# EAGLE design X14-Backplane (EAGLE 9.5.0)
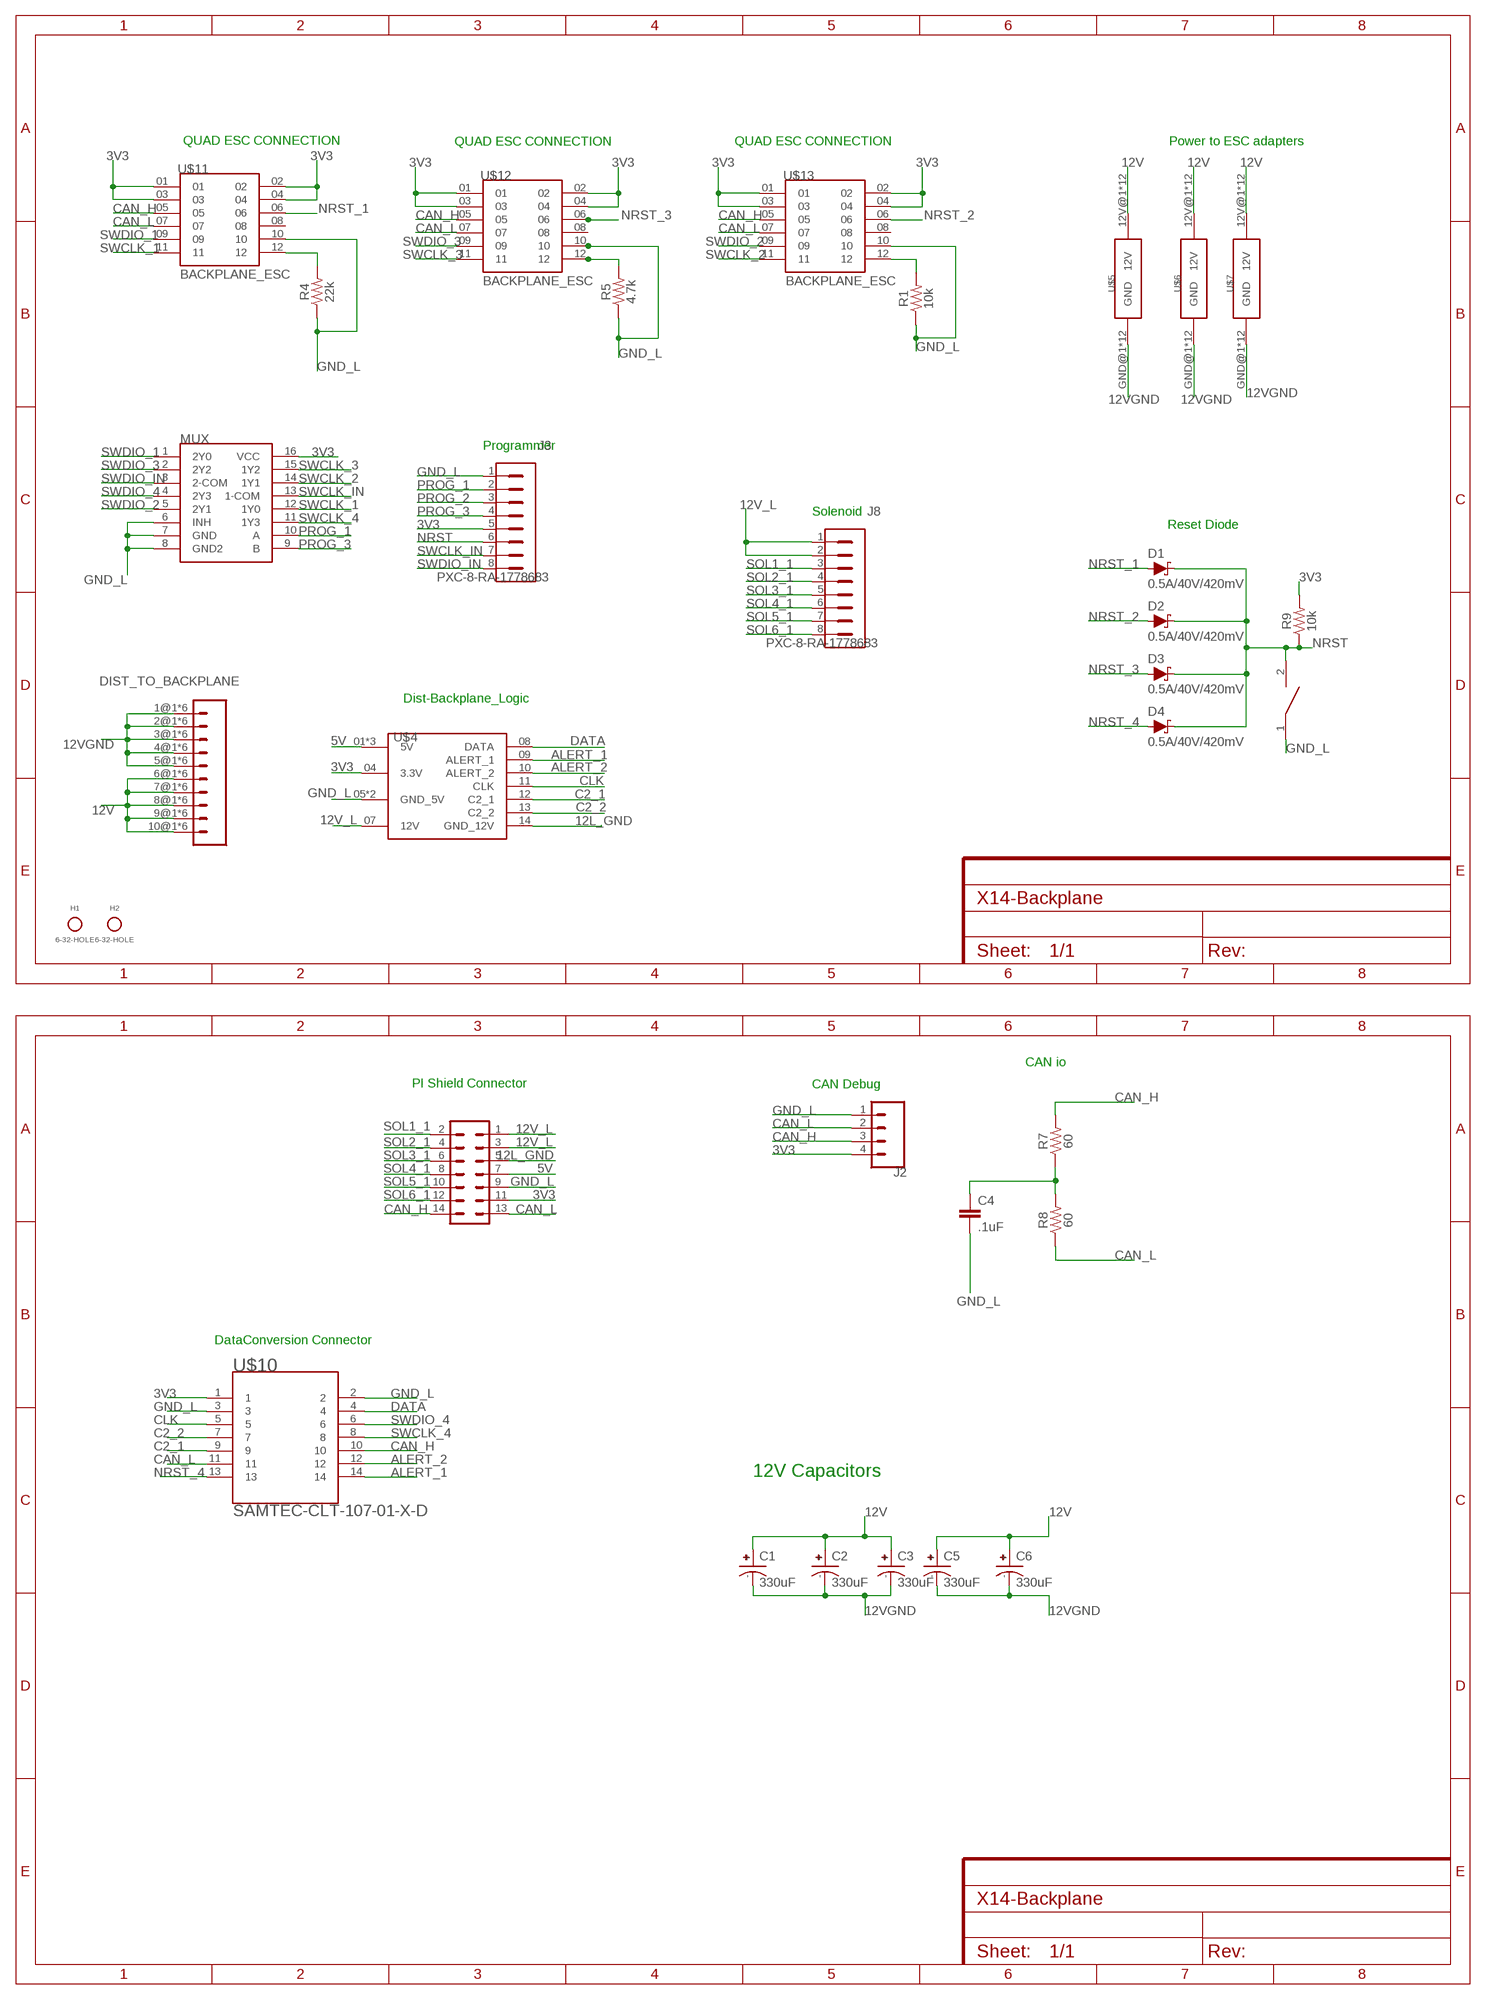
[diagram p0: schematic, sheet 1]

## Parts
C1  330uF  UCM1H331MNL1GS  [CAPAE1030X1050N]
C2  330uF  UCM1H331MNL1GS  [CAPAE1030X1050N]
C3  330uF  UCM1H331MNL1GS  [CAPAE1030X1050N]
C4  .1uF  10NF-0603-50V-10%  [0603]
C5  330uF  UCM1H331MNL1GS  [CAPAE1030X1050N]
C6  330uF  UCM1H331MNL1GS  [CAPAE1030X1050N]
D1  0.5A/40V/420mV  DIODE-SCHOTTKY-PMEG4005EJ  [SOD-323]
D2  0.5A/40V/420mV  DIODE-SCHOTTKY-PMEG4005EJ  [SOD-323]
D3  0.5A/40V/420mV  DIODE-SCHOTTKY-PMEG4005EJ  [SOD-323]
D4  0.5A/40V/420mV  DIODE-SCHOTTKY-PMEG4005EJ  [SOD-323]
DIST_TO_BACKPLANE  MPPT-10-01-01-L-RA-SD  [MPPT-10-01-01-L-RA-SD]
H1  6-32-HOLE  [6-32-HOLE]
H2  6-32-HOLE  [6-32-HOLE]
J2  PXC-PTSM-04-RA-1778641  [PXC-PTSM-04-RA-1778641]
J3  PXC-8-RA-1778683  [PXC-8-RA-1778683]
J8  PXC-8-RA-1778683  [PXC-8-RA-1778683]
MUX  TI-SN74LV4052A  [SOIC-16]
R1  10k  10KOHM-0603-1/10W-1%  [0603]
R4  22k  26.7KOHM0603-1/10W-1%  [0603]
R5  4.7k  1KOHM-0603-1/10W-1%  [0603]
R7  60  68.1KOHM-0603-1/10W-1%  [0603]
R8  60  68.1KOHM-0603-1/10W-1%  [0603]
R9  10k  10KOHM-0603-1/10W-1%  [0603]
U$4  BACKPLANE-DISTRIBUTION  [SAMTEC_IPL1-107-01-X-D-K(B-D)]
U$5  BACKPLANE_ESC_ADAPTER_PWRBKP  [BACKPLANE_ESC_ADAPTER_BKP_PWR]
U$6  BACKPLANE_ESC_ADAPTER_PWRBKP  [BACKPLANE_ESC_ADAPTER_BKP_PWR]
U$7  BACKPLANE_ESC_ADAPTER_PWRBKP  [BACKPLANE_ESC_ADAPTER_BKP_PWR]
U$8  DISCRETECOMPONENTS_SWITCH  [DISCRETECOMPONENTS_SW_2512]
U$9  7X_CONN  [IPL7X2]
U$10  BACKPLANE->DATACONV  [SAMTEC-CLT-107-01-X-D-BACKPLANE]
U$11  BACKPLANE_ESC  [SAMTEC_SQT-107-01-F-D]
U$12  BACKPLANE_ESC  [SAMTEC_SQT-107-01-F-D]
U$13  BACKPLANE_ESC  [SAMTEC_SQT-107-01-F-D]

## Nets
3V3: J2.4 J3.5 MUX.16(VCC) R9.2 U$4.04(3.3V) U$9.11 U$10.1 U$11.01 U$11.02 U$11.03 U$11.04 U$12.01 U$12.02 U$12.03 U$12.04 U$13.01 U$13.02 U$13.03 U$13.04
5V: U$4.01(5V) U$4.02(5V) U$4.03(5V) U$9.7
12L_GND: U$4.14(GND_12V) U$9.5
12V: C1.+ C2.+ C3.+ C5.+ C6.+ DIST_TO_BACKPLANE.6@1 DIST_TO_BACKPLANE.6@2 DIST_TO_BACKPLANE.6@3 DIST_TO_BACKPLANE.6@4 DIST_TO_BACKPLANE.6@5 DIST_TO_BACKPLANE.6@6 DIST_TO_BACKPLANE.7@1 DIST_TO_BACKPLANE.7@2 DIST_TO_BACKPLANE.7@3 DIST_TO_BACKPLANE.7@4 DIST_TO_BACKPLANE.7@5 DIST_TO_BACKPLANE.7@6 DIST_TO_BACKPLANE.8@1 DIST_TO_BACKPLANE.8@2 DIST_TO_BACKPLANE.8@3 DIST_TO_BACKPLANE.8@4 DIST_TO_BACKPLANE.8@5 DIST_TO_BACKPLANE.8@6 DIST_TO_BACKPLANE.9@1 DIST_TO_BACKPLANE.9@2 DIST_TO_BACKPLANE.9@3 DIST_TO_BACKPLANE.9@4 DIST_TO_BACKPLANE.9@5 DIST_TO_BACKPLANE.9@6 DIST_TO_BACKPLANE.10@1 DIST_TO_BACKPLANE.10@2 DIST_TO_BACKPLANE.10@3 DIST_TO_BACKPLANE.10@4 DIST_TO_BACKPLANE.10@5 DIST_TO_BACKPLANE.10@6 U$5.12V@1(12V) U$5.12V@2(12V) U$5.12V@3(12V) U$5.12V@4(12V) U$5.12V@5(12V) U$5.12V@6(12V) U$5.12V@7(12V) U$5.12V@8(12V) U$5.12V@9(12V) U$5.12V@10(12V) U$5.12V@11(12V) U$5.12V@12(12V) U$6.12V@1(12V) U$6.12V@2(12V) U$6.12V@3(12V) U$6.12V@4(12V) U$6.12V@5(12V) U$6.12V@6(12V) U$6.12V@7(12V) U$6.12V@8(12V) U$6.12V@9(12V) U$6.12V@10(12V) U$6.12V@11(12V) U$6.12V@12(12V) U$7.12V@1(12V) U$7.12V@2(12V) U$7.12V@3(12V) U$7.12V@4(12V) U$7.12V@5(12V) U$7.12V@6(12V) U$7.12V@7(12V) U$7.12V@8(12V) U$7.12V@9(12V) U$7.12V@10(12V) U$7.12V@11(12V) U$7.12V@12(12V)
12V_L: J8.1 J8.2 U$4.07(12V) U$9.1 U$9.3
12VGND: C1.- C2.- C3.- C5.- C6.- DIST_TO_BACKPLANE.1@1 DIST_TO_BACKPLANE.1@2 DIST_TO_BACKPLANE.1@3 DIST_TO_BACKPLANE.1@4 DIST_TO_BACKPLANE.1@5 DIST_TO_BACKPLANE.1@6 DIST_TO_BACKPLANE.2@1 DIST_TO_BACKPLANE.2@2 DIST_TO_BACKPLANE.2@3 DIST_TO_BACKPLANE.2@4 DIST_TO_BACKPLANE.2@5 DIST_TO_BACKPLANE.2@6 DIST_TO_BACKPLANE.3@1 DIST_TO_BACKPLANE.3@2 DIST_TO_BACKPLANE.3@3 DIST_TO_BACKPLANE.3@4 DIST_TO_BACKPLANE.3@5 DIST_TO_BACKPLANE.3@6 DIST_TO_BACKPLANE.4@1 DIST_TO_BACKPLANE.4@2 DIST_TO_BACKPLANE.4@3 DIST_TO_BACKPLANE.4@4 DIST_TO_BACKPLANE.4@5 DIST_TO_BACKPLANE.4@6 DIST_TO_BACKPLANE.5@1 DIST_TO_BACKPLANE.5@2 DIST_TO_BACKPLANE.5@3 DIST_TO_BACKPLANE.5@4 DIST_TO_BACKPLANE.5@5 DIST_TO_BACKPLANE.5@6 U$5.GND@1(GND) U$5.GND@2(GND) U$5.GND@3(GND) U$5.GND@4(GND) U$5.GND@5(GND) U$5.GND@6(GND) U$5.GND@7(GND) U$5.GND@8(GND) U$5.GND@9(GND) U$5.GND@10(GND) U$5.GND@11(GND) U$5.GND@12(GND) U$6.GND@1(GND) U$6.GND@2(GND) U$6.GND@3(GND) U$6.GND@4(GND) U$6.GND@5(GND) U$6.GND@6(GND) U$6.GND@7(GND) U$6.GND@8(GND) U$6.GND@9(GND) U$6.GND@10(GND) U$6.GND@11(GND) U$6.GND@12(GND) U$7.GND@1(GND) U$7.GND@2(GND) U$7.GND@3(GND) U$7.GND@4(GND) U$7.GND@5(GND) U$7.GND@6(GND) U$7.GND@7(GND) U$7.GND@8(GND) U$7.GND@9(GND) U$7.GND@10(GND) U$7.GND@11(GND) U$7.GND@12(GND)
ALERT_1: U$4.09(ALERT_1) U$10.14
ALERT_2: U$4.10(ALERT_2) U$10.12
C2_1: U$4.12(C2_1) U$10.9
C2_2: U$4.13(C2_2) U$10.7
CAN_H: J2.3 R7.2 U$9.14 U$10.10 U$11.05 U$12.05 U$13.05
CAN_L: J2.2 R8.1 U$9.13 U$10.11 U$11.07 U$12.07 U$13.07
CLK: U$4.11(CLK) U$10.5
DATA: U$4.08(DATA) U$10.4
ESCID_1: R4.2 U$11.12
ESCID_2: R1.2 U$13.12
ESCID_3: R5.2 U$12.12
GND_L: C4.2 J2.1 J3.1 MUX.6(INH) MUX.7(GND) MUX.8(GND2) R1.1 R4.1 R5.1 U$4.05(GND_5V) U$4.06(GND_5V) U$8.1 U$9.9 U$10.2 U$10.3 U$11.10 U$12.10 U$13.10
N$3: C4.1 R7.1 R8.2
NRST: D1.C D2.C D3.C D4.C J3.6 R9.1 U$8.2
NRST_1: D1.A U$11.06
NRST_2: D2.A U$13.06
NRST_3: D3.A U$12.06
NRST_4: D4.A U$10.13
PROG_1: J3.2 MUX.10(A)
PROG_2: J3.3
PROG_3: J3.4 MUX.9(B)
SOL1_1: J8.3 U$9.2
SOL2_1: J8.4 U$9.4
SOL3_1: J8.5 U$9.6
SOL4_1: J8.6 U$9.8
SOL5_1: J8.7 U$9.10
SOL6_1: J8.8 U$9.12
SWCLK_1: MUX.12(1Y0) U$11.11
SWCLK_2: MUX.14(1Y1) U$13.11
SWCLK_3: MUX.15(1Y2) U$12.11
SWCLK_4: MUX.11(1Y3) U$10.8
SWCLK_IN: J3.7 MUX.13(1-COM)
SWDIO_1: MUX.1(2Y0) U$11.09
SWDIO_2: MUX.5(2Y1) U$13.09
SWDIO_3: MUX.2(2Y2) U$12.09
SWDIO_4: MUX.4(2Y3) U$10.6
SWDIO_IN: J3.8 MUX.3(2-COM)
Unconnected: U$11.08 U$12.08 U$13.08

## Notes on the sheet
- QUAD ESC CONNECTION | QUAD ESC CONNECTION | QUAD ESC CONNECTION | Power to ESC adapters
- Programmer
- Solenoid
- Reset Diode
- Dist-Backplane_Logic
- CAN io
- PI Shield Connector | CAN Debug
- DataConversion Connector
- 12V Capacitors

## Library data of the parts
C1-C3 C5 C6 = CAP, aluminin-capacitor-brick-UCM1H331MNL1GS:UCM1H331MNL1GS: Nichicon 330uF 50 V Aluminium Electrolytic Capacitor SMD, CM Series 2000h 10 (Dia.) x 10mm Source: Datasheet <http://www.nichicon.co.jp/english/products/pdfs/e-ucm.pdf>; ARROW_PART_NUMBER: UCM1H331MNL1GS; ARROW_PRICE-STOCK: https://www.arrow.com/en/products/ucm1h331mnl1gs/nichicon; DESCRIPTION: Nichicon 330uF 50 V Aluminium Electrolytic Capacitor SMD, CM Series 2000h 10 (Dia.) x 10mm; HEIGHT: 10.5mm; MANUFACTURER_NAME: Nichicon; MANUFACTURER_PART_NUMBER: UCM1H331MNL1GS; MOUSER_PART_NUMBER: 647-UCM1H331MNL1GS; MOUSER_PRICE-STOCK: https://www.mouser.co.uk/ProductDetail/Nichicon/UCM1H331MNL1GS?qs=DSgADHjnLTkTovFLdbC%252BNg%3D%3D
C4 = SparkFun-Capacitors:10NF: 0.01uF/10nF/10,000pF ceramic capacitors A capacitor is a passive two-terminal electrical component used to store electrical energy temporarily in an electric field. CAP-09321; PROD_ID: CAP-00867; VALUE: 10nF
D1-D4 = SparkFun-DiscreteSemi:DIODE-SCHOTTKY: Schottky diode A Schottky diode is a semiconductor diode which has a low forward voltage drop and a very fast switching action.; PROD_ID: DIO-10955
DIST_TO_BACKPLANE = CONN, Samtec MPPT Hermaphoditic 10 pos - MPPT-10-01-01-L-RA-SD:MPPT-10-01-01-L-RA-SD: Samtec MPPT Connector Right Angle Vertically mating Non-gendered https://www.samtec.com/products/mppt-10-01-01-l-ra-sd
H1 H2 = Mounting Holes:6-32-HOLE
J2 = CONN, Phoenix Contact PTSM-04-V-1778573:PXC-PTSM-04-RA-1778641
J3 J8 = CONN, Phoenix Contact PTSM 8 pin:PXC-8-RA-1778683
MUX = BackplaneMUX:TI-SN74LV4052A
R1 R9 = SparkFun-Resistors:10KOHM: 10kΩ resistor A resistor is a passive two-terminal electrical component that implements electrical resistance as a circuit element. Resistors act to reduce current flow, and, at the same time, act to lower voltage levels within circuits. - Wikipedia; PROD_ID: RES-00824
R4 = SparkFun-Resistors:26.7KOHM: 26.7kΩ resistor A resistor is a passive two-terminal electrical component that implements electrical resistance as a circuit element. Resistors act to reduce current flow, and, at the same time, act to lower voltage levels within circuits. - Wikipedia; PROD_ID: RES-12186; VALUE: 26.7k
R5 = SparkFun-Resistors:1KOHM: 1kΩ resistor A resistor is a passive two-terminal electrical component that implements electrical resistance as a circuit element. Resistors act to reduce current flow, and, at the same time, act to lower voltage levels within circuits. - Wikipedia; PROD_ID: RES-07856; VALUE: 1k
R7 R8 = SparkFun-Resistors:68.1KOHM: 68.1kΩ resistor A resistor is a passive two-terminal electrical component that implements electrical resistance as a circuit element. Resistors act to reduce current flow, and, at the same time, act to lower voltage levels within circuits. - Wikipedia; PROD_ID: RES-09380; VALUE: 68.1k
U$4 = CONN, Distribution-Backplane:BACKPLANE-DISTRIBUTION
U$5-U$7 = CONN, Backplane_ESC_adapter:BACKPLANE_ESC_ADAPTER_PWR
U$8 = OTHER, Push button - FSM2JMTR:DISCRETECOMPONENTS_SWITCH: TE Connectivity FSM2JMTR Switch
U$9 = PI-SHIELD, Solenoid-Backplane:7X_CONN
U$10 = CONN, DataConversion-Backplane Connector- SAMTEC CLT-107-01-F-D:BACKPLANE->DATACONV
U$11-U$13 = SQT-106-01-F-D:BACKPLANE_ESC

## Net classes
2 5V: width 0.508 mm

## Board
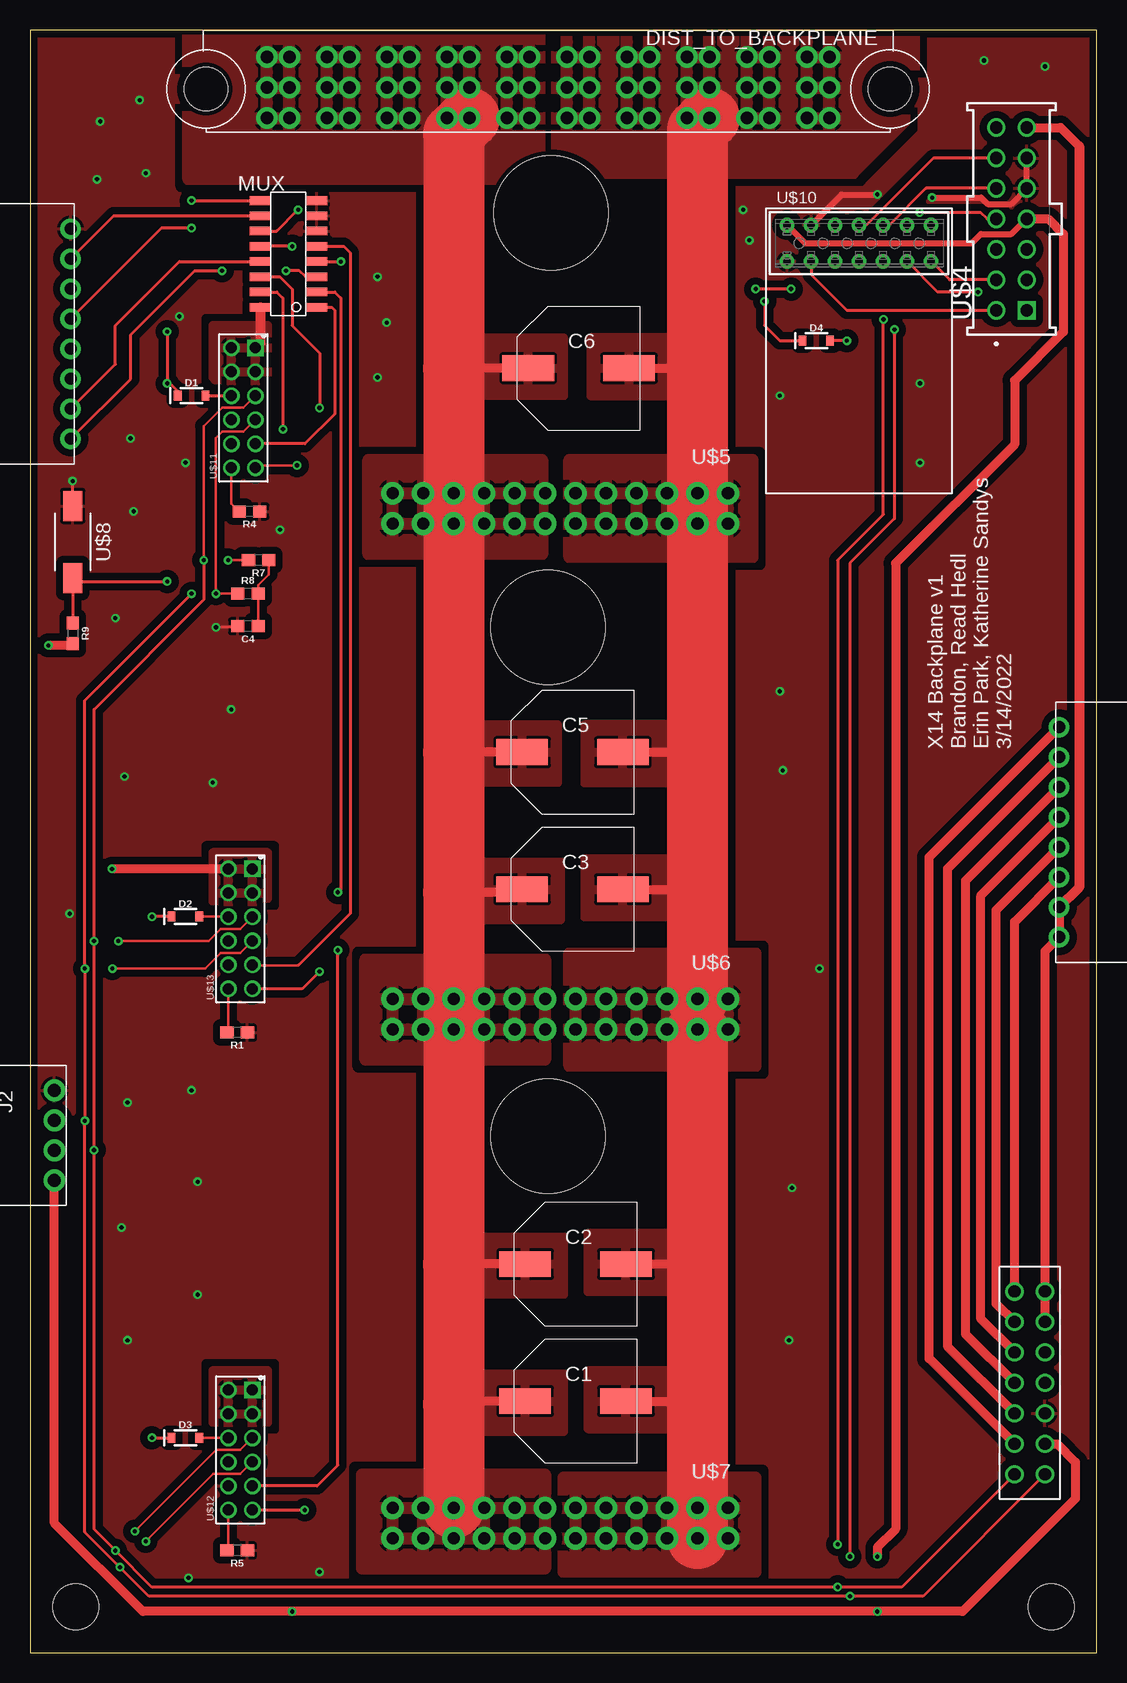
[diagram p1: board, top side]
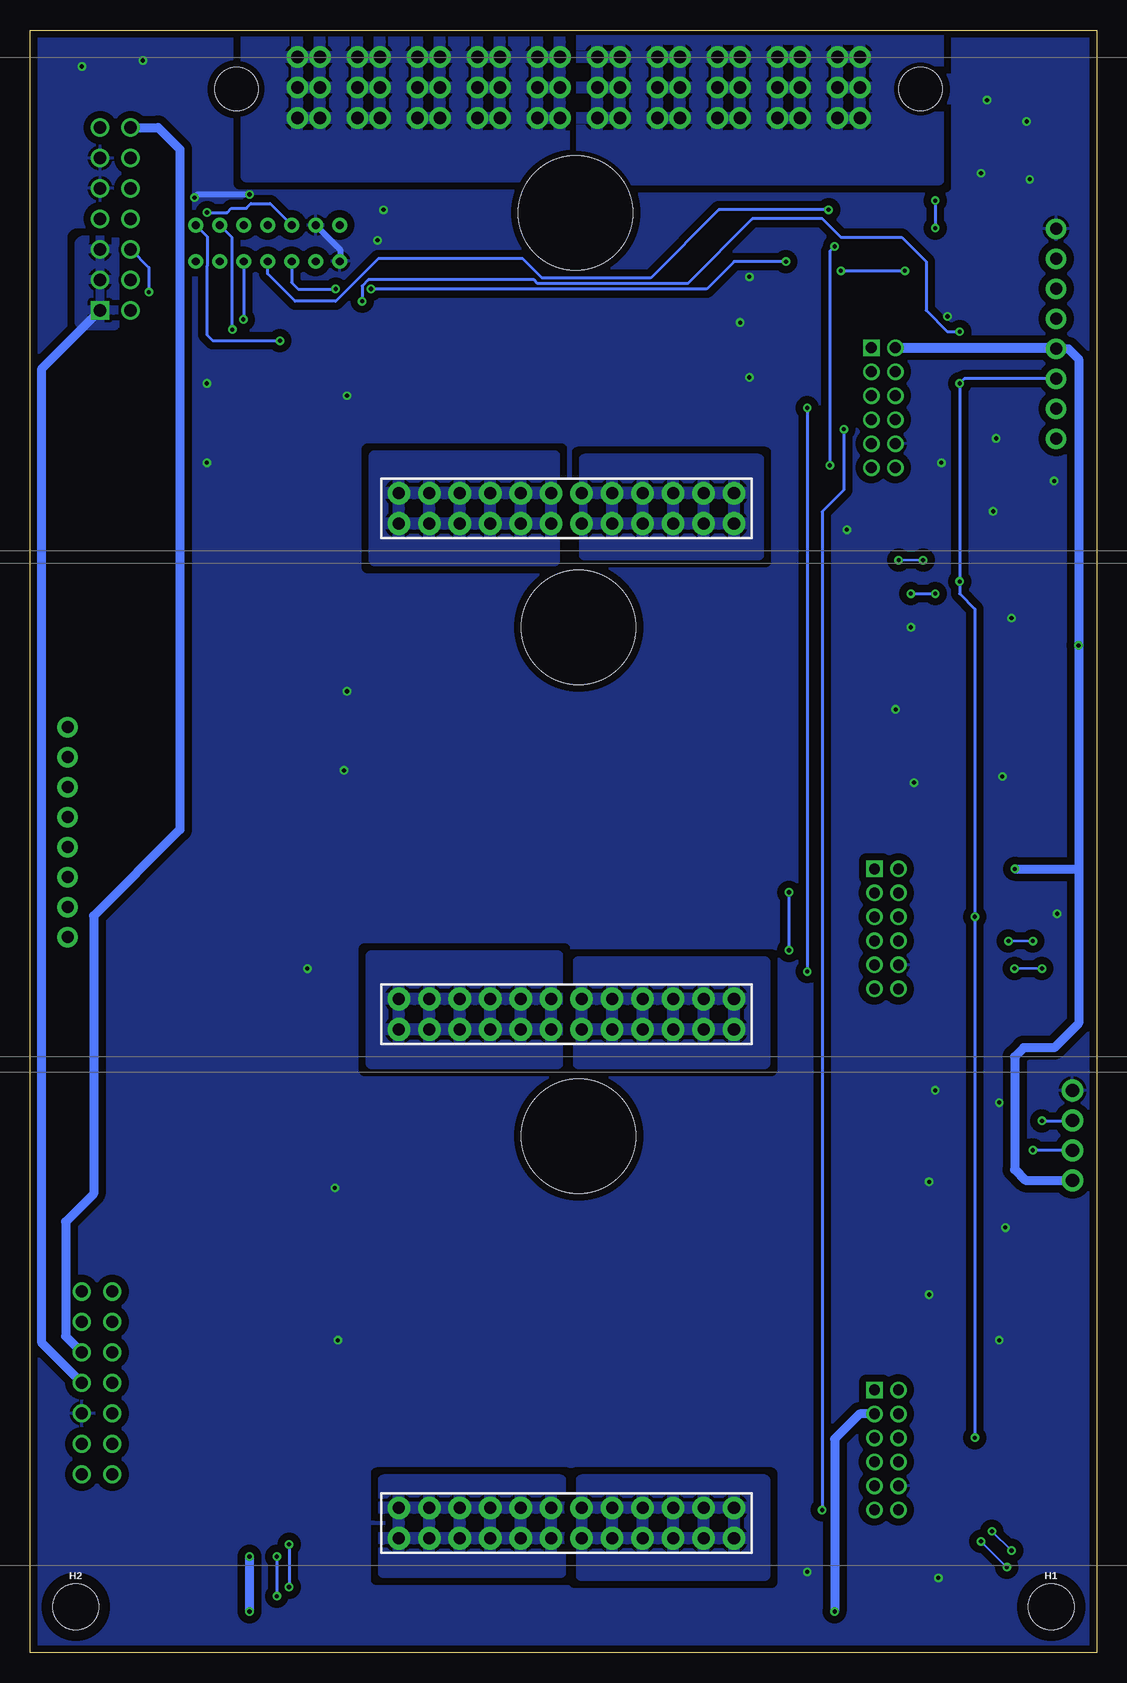
[diagram p2: board, bottom side, seen from below]

Size 88.9 x 135.25 mm. Coordinates in mm from the lower left corner, seen from the top.
Outline: 0,0 88.9,0 88.9,135.25 0,135.25 0,0
Copper layers (1*16): Top 0.0356mm / dielectric 1.5011mm / Bottom 0.0356mm
Design rules "ECE_Senior_Design": minimum track width 8mil, minimum drill 13mil, track to track 8mil, track to pad 8mil, pad to pad 6mil, via to via 8mil, smd to smd 6mil, copper to edge 15mil, drill to drill 8mil, minimum pad ring 7mil, minimum via ring 7mil, stop-mask expansion 3mil, vias tented up to drill 0mil, thermal gap 10mil
Holes 9.53 mm at 43.18,43.05 43.18,85.47 43.43,120.01

### Footprints (pad centres in the part's own frame; a part is rotated, then mirrored left to right if it is on the bottom)
CAPAE1030X1050N = smd 4.3 x 2.15: + -4.2,0; - 4.2,0
0603 = smd 1.1 x 1: 1 -0.85,0; 2 0.85,0
SOD-323 = smd 0.63 x 0.83: A 1.15,0; C -1.15,0
MPPT-10-01-01-L-RA-SD = drill 1.04 pad 1.8: 1@1 -23.44,2.26; 1@2 -21.56,2.26; 1@3 -23.44,4.8; 1@4 -21.56,4.8; 1@5 -23.44,7.34; 1@6 -21.56,7.34; 2@1 -18.44,2.26; 2@2 -16.56,2.26; 2@3 -18.44,4.8; 2@4 -16.56,4.8; 2@5 -18.44,7.34; 2@6 -16.56,7.34; 3@1 -13.44,2.26; 3@2 -11.56,2.26; 3@3 -13.44,4.8; 3@4 -11.56,4.8; 3@5 -13.44,7.34; 3@6 -11.56,7.34; 4@1 -8.44,2.26; 4@2 -6.56,2.26; 4@3 -8.44,4.8; 4@4 -6.56,4.8; 4@5 -8.44,7.34; 4@6 -6.56,7.34; 5@1 -3.44,2.26; 5@2 -1.56,2.26; 5@3 -3.44,4.8; 5@4 -1.56,4.8; 5@5 -3.44,7.34; 5@6 -1.56,7.34; 6@1 1.56,2.26; 6@2 3.44,2.26; 6@3 1.56,4.8; 6@4 3.44,4.8; 6@5 1.56,7.34; 6@6 3.44,7.34; 7@1 6.56,2.26; 7@2 8.44,2.26; 7@3 6.56,4.8; 7@4 8.44,4.8; 7@5 6.56,7.34; 7@6 8.44,7.34; 8@1 11.56,2.26; 8@2 13.44,2.26; 8@3 11.56,4.8; 8@4 13.44,4.8; 8@5 11.56,7.34; 8@6 13.44,7.34; 9@1 16.56,2.26; 9@2 18.44,2.26; 9@3 16.56,4.8; 9@4 18.44,4.8; 9@5 16.56,7.34; 9@6 18.44,7.34; 10@1 21.56,2.26; 10@2 23.44,2.26; 10@3 21.56,4.8; 10@4 23.44,4.8; 10@5 21.56,7.34; 10@6 23.44,7.34 | hole 3.6: 28.5,4.93; -28.5,4.93
6-32-HOLE = hole 3.81: 0,0
PXC-PTSM-04-RA-1778641 = drill 1.1 pad 1.8: 1 0,0; 2 2.5,0; 3 5,0; 4 7.5,0
PXC-8-RA-1778683 = drill 1 pad 1.7: 1 2.1,7.2; 2 4.6,7.2; 3 7.1,7.2; 4 9.6,7.2; 5 12.1,7.2; 6 14.6,7.2; 7 17.1,7.2; 8 19.6,7.2
SOIC-16 = smd 1.78 x 0.72: 1 0,0; 2 0,-1.27; 3 0,-2.54; 4 0,-3.81; 5 0,-5.08; 6 0,-6.35; 7 0,-7.62; 8 0,-8.89; 9 4.68,-8.89; 10 4.68,-7.62; 11 4.68,-6.35; 12 4.68,-5.08; 13 4.68,-3.81; 14 4.68,-2.54; 15 4.68,-1.27; 16 4.68,0
SAMTEC_IPL1-107-01-X-D-K(B-D) = drill 1.02 square: 01 -7.62,-1.27 | drill 1.02: 02 -5.08,-1.27; 03 -2.54,-1.27; 04 0,-1.27; 05 2.54,-1.27; 06 5.08,-1.27; 07 7.62,-1.27; 08 -7.62,1.27; 09 -5.08,1.27; 10 -2.54,1.27; 11 0,1.27; 12 2.54,1.27; 13 5.08,1.27; 14 7.62,1.27
BACKPLANE_ESC_ADAPTER_BKP_PWR = drill 1.016 pad 1.88: 12V@1 65.024,36.322; 12V@2 65.024,38.862; 12V@3 62.484,36.322; 12V@4 62.484,38.862; 12V@5 59.944,36.322; 12V@6 59.944,38.862; 12V@7 57.404,36.322; 12V@8 57.404,38.862; 12V@9 54.864,36.322; 12V@10 54.864,38.862; 12V@11 52.324,36.322; 12V@12 52.324,38.862; GND@1 49.784,38.862; GND@2 49.784,36.322; GND@3 47.244,38.862; GND@4 47.244,36.322; GND@5 44.704,38.862; GND@6 44.704,36.322; GND@7 42.164,38.862; GND@8 42.164,36.322; GND@9 39.624,38.862; GND@10 39.624,36.322; GND@11 37.084,38.862; GND@12 37.084,36.322
DISCRETECOMPONENTS_SW_2512 = smd 2.5 x 1.6: 1 -3,0; 2 3,0
IPL7X2 = drill 1.016 pad 1.524: 1 2.032,3.81; 2 2.032,1.27; 3 4.572,3.81; 4 4.572,1.27; 5 7.112,3.81; 6 7.112,1.27; 7 9.652,3.81; 8 9.652,1.27; 9 12.192,3.81; 10 12.192,1.27; 11 14.732,3.81; 12 14.732,1.27; 13 17.272,3.81; 14 17.272,1.27
SAMTEC-CLT-107-01-X-D-BACKPLANE = drill 0.64 pad 1.24: 1 -6,1.511; 2 -6,-1.511; 3 -4,1.511; 4 -4,-1.511; 5 -2,1.511; 6 -2,-1.511; 7 0,1.511; 8 0,-1.511; 9 2,1.511; 10 2,-1.511; 11 4,1.511; 12 4,-1.511; 13 6,1.511; 14 6,-1.511
SAMTEC_SQT-107-01-F-D = drill 0.91 pad 1.26 square: 01 5,-1 | drill 0.91 pad 1.26: 02 5,1; 03 3,-1; 04 3,1; 05 1,-1; 06 1,1; 07 -1,-1; 08 -1,1; 09 -3,-1; 10 -3,1; 11 -5,-1; 12 -5,1

### Placement (x,y rotation side)
C1  45.47,20.95 0 top
C2  45.47,32.38 0 top
C3  45.21,63.63 0 top
C4  18.16,85.55 180 top
C5  45.21,75.06 0 top
C6  45.72,107.06 0 top
D1  13.46,104.78 0 top
D2  12.95,61.34 0 top
D3  12.95,17.91 0 top
D4  65.53,109.35 0 top
DIST_TO_BACKPLANE  43.18,135.25 180 top
H1  3.81,3.81 0 bottom
H2  85.09,3.81 0 bottom
J2  2.03,46.86 270 top
J3  -3.81,120.78 270 top
J8  92.96,57.53 90 top
MUX  23.88,112.14 180 top
R1  17.27,51.69 180 top
R4  18.29,95.12 180 top
R5  17.27,8.51 180 top
R7  19.05,91.06 180 top
R8  18.16,88.29 0 top
R9  3.56,84.96 270 top
U$4  81.79,119.51 90 top
U$5  95.25,132.97 180 top
U$6  95.25,90.81 180 top
U$7  95.25,48.39 180 top
U$8  3.56,92.58 270 top
U$9  80.77,32.13 270 top
U$10  69.09,117.47 0 top
U$11  17.78,103.76 90 top
U$12  17.53,16.89 90 top
U$13  17.53,60.32 90 top

### Tracks (layer width: path | path; a pad name or v marks a point on that pad's centre or on a via)
3V3  (via drill 0.35)
  Top 0.508: U$10.1 64.6,117.47 78.49,117.47 79.25,118.24 81.79,118.24 U$4.04
  Top 0.762: U$9.11 85.6,17.4 87.12,15.88 87.12,12.83 77.72,3.43 v70.61,3.43 v21.84,3.43 9.4,3.43 2.03,10.79 J2.4 | R9.2 3.39,83.95 v1.52,83.95 | U$4.04 84.84,119.51 86.11,118.24 86.11,110.11 82.04,106.04 82.04,100.71 72.14,90.81 72.14,10.29 70.61,8.76 v70.61,8 | v6.83,65.33 U$13.02
  Top 0.813: MUX.16 19.2,109.18 U$11.01
  Bottom 0.762: 1.52,65.41 v1.52,83.95 1.52,107.82 2.38,108.68 J3.5 | v70.61,8 v70.61,3.43 | 1.52,65.41 1.6,65.33 v6.83,65.33 | v21.84,3.43 21.84,17.81 19.76,19.89 U$12.03 | 1.52,65.41 1.52,52.45 3.56,50.42 6.1,50.42 6.86,49.66 6.86,40.26 5.96,39.36 J2.4
  Bottom 0.813: U$11.02 3.47,108.76 J3.5
  pour Top: 15.24,110.62 15.24,106.3 15.49,106.04 19.81,106.04 19.81,110.62
  pour Top: 15.24,66.68 15.24,62.61 19.56,62.61 19.81,62.87 19.81,66.68
  pour Top: 15.24,23.5 15.24,19.18 19.81,19.18 19.81,23.5
5V
  Bottom 0.762: U$9.7 87.91,25.81 87.91,107.04 U$4.01
  pour Bottom: 82.04,117.73 84.58,117.73 84.84,117.47 84.84,110.87 84.58,110.62 81.79,110.62 81.79,117.73
12L_GND
  Bottom 0.762: U$4.14 78.23,127.13 76.4,125.3 76.4,68.6 83.59,61.42 83.59,38.25 85.93,35.92 85.93,26.36 U$9.5
12V
  Top 0.762: C6.+ 35.31,107.06 | C5.+ 35.31,75.06 | C3.+ 40.76,63.37 35.31,63.37 | C2.+ 35.31,32.38 | C1.+ 35.56,20.95 35.31,20.7
  Top 5.08: DIST_TO_BACKPLANE.7@5 35.31,126.6 35.31,107.06 U$5.12V@5 35.31,75.06 35.31,63.37 U$6.12V@5 35.31,32.38 35.31,20.7 U$7.12V@5
  pour Bottom: 15.75,138.81 40.89,138.81 42.93,136.78 42.93,122.81 13.21,122.81 13.21,136.27
  pour Top: 16.26,139.06 40.64,139.06 42.42,137.29 42.42,122.81 13.21,122.81 13.21,136.02
  pour Top (isolate 0.508): 28.19,99.44 42.67,99.44 42.67,91.57 28.19,91.57
  pour Bottom (isolate 0.508): 28.19,99.44 42.67,99.44 42.67,91.57 28.19,91.57
  pour Top (isolate 0.508): 27.94,57.78 42.93,57.78 42.93,49.4 27.94,49.4
  pour Bottom (isolate 0.508): 27.69,57.53 43.18,57.53 43.18,49.15 27.69,49.15
  pour Top (isolate 0.508): 27.69,14.86 42.93,14.86 42.93,6.98 27.69,6.98
  pour Bottom (isolate 0.508): 27.69,14.35 42.93,14.35 42.93,6.48 27.69,6.48
  pour Top: 36.07,109.6 44.45,109.6 44.45,104.78 36.07,104.78
  pour Top: 36.07,23.24 44.45,23.24 44.45,18.41 36.07,18.41
  pour Top: 36.07,34.67 44.45,34.67 44.45,29.84 36.07,29.84
  pour Top: 35.81,65.91 44.2,65.91 44.2,61.09 35.81,61.09
  pour Top: 35.56,77.34 43.94,77.34 43.94,72.52 35.56,72.52
12V_L
  Top 0.762: J8.2 J8.1 84.58,58.45 U$9.1 U$9.3 | U$4.07 85.88,127.13 87.43,125.58
  Top 0.813: J8.2 87.43,63.79 87.43,125.58
12VGND
  Top 0.762: C6.- 55.63,107.06 | C5.- 55.37,75.06 55.63,74.8 | C3.- 55.37,63.63 55.63,63.37 | C2.- 55.37,32.38 55.63,32.13 | C1.- 55.37,20.95 55.63,20.7
  Top 5.08: U$7.GND@9 55.63,20.7 55.63,32.13 U$6.GND@9 | U$6.GND@10 55.63,63.37 55.63,74.8 U$5.GND@9 55.63,107.06 55.63,126.92 DIST_TO_BACKPLANE.3@5
  pour Top (isolate 0.508): 45.47,138.56 71.63,138.56 73.66,136.53 73.66,128.4 68.58,123.32 43.94,123.32 43.94,137.03
  pour Bottom (isolate 0.508, rank 2): 45.21,91.06 45.21,99.69 60.2,99.69 60.2,91.06
  pour Top (isolate 0.508, rank 2): 44.96,99.44 60.2,99.44 60.2,91.31 44.96,91.31
  pour Bottom (isolate 0.508, rank 2): 44.96,58.04 60.45,58.04 60.45,49.15 44.96,49.15
  pour Top (isolate 0.508, rank 2): 44.96,58.29 60.45,58.29 60.45,48.9 44.96,48.9
  pour Top (isolate 0.508, rank 2): 44.45,14.61 60.45,14.61 60.45,6.73 44.45,6.73
  pour Bottom (isolate 0.508, rank 2): 44.7,14.35 59.44,14.35 59.44,6.73 44.7,6.73
  pour Bottom (isolate 0.508, rank 2): 43.94,136.27 70.87,136.27 70.87,123.06 43.94,123.06
  pour Top: 46.74,109.6 46.74,104.78 55.37,104.78 55.37,109.6
  pour Top: 46.48,23.5 46.48,18.67 55.12,18.67 55.12,23.5
  pour Top: 46.48,34.92 46.48,30.1 55.12,30.1 55.12,34.92
  pour Top: 46.23,66.17 46.23,61.34 54.86,61.34 54.86,66.17
  pour Top: 46.23,77.34 46.23,72.52 54.86,72.52 54.86,77.34
ALERT_1
  Top 0.254: U$4.09 76.62,114.43 U$10.14
ALERT_2  (via drill 0.35)
  Top 0.254: v78.99,113.41 75.64,113.41 U$10.12
  Bottom 0.254: U$4.10 78.99,115.44 v78.99,113.41
C2_1
  Top 0.254: U$4.12 74.66,122.05 71.6,118.99 U$10.9
C2_2
  Top 0.254: U$4.13 75.29,124.59 69.69,118.99 U$10.7
CAN_H  (via drill 0.35)
  Top 0.203: v8.74,10.11 15.52,16.89 17.53,16.89 U$12.05 | v7.37,59.31 14.88,59.31 15.89,60.32 17.53,60.32 U$13.05 | v14.48,91.06 14.48,102.24 16,103.76 17.78,103.76 U$11.05 | R7.2 v16.51,91.06
  Top 0.254: U$9.14 72.64,5.46 v67.31,5.46 10.16,5.46 v7.11,8.51 5.33,10.29 v5.33,41.88 v5.33,59.31 5.33,78.61 14.48,87.76 v14.48,91.06 | v67.31,9.02 67.31,91.06 71.12,94.87 v71.12,111.12
  Bottom 0.203: v8.74,10.11 7.14,8.51 | v5.33,59.31 v7.37,59.31 | v16.51,91.06 v14.48,91.06
  Bottom 0.254: v7.11,8.51 7.14,8.51 | J2.3 5.31,41.86 v5.33,41.88 | U$10.10 71.09,111.16 v71.12,111.12 | v67.31,9.02 v67.31,5.46
CAN_L  (via drill 0.35)
  Top 0.203: v9.65,9.27 15.27,14.89 17.53,14.89 U$12.07 | v6.86,57.02 14.59,57.02 15.89,58.33 17.53,58.33 U$13.07 | R8.1 17.29,88.26 v15.49,88.26 15.49,101.22 16.03,101.76 17.78,101.76 U$11.07
  Top 0.254: U$9.13 74.42,4.7 v68.33,4.7 9.91,4.7 v7.49,7.11 4.57,10.03 v4.57,44.32 v4.57,57.02 4.57,79.38 v13.46,88.26 | v72.03,110.29 72.03,94.51 68.33,90.81 v68.33,8
  Bottom 0.203: v9.65,9.27 v7.49,7.11 | v6.86,57.02 v4.57,57.02
  Bottom 0.254: v15.49,88.26 v13.46,88.26 | v4.57,44.32 2.07,44.32 J2.2 | U$10.11 72.08,117.98 72.08,110.34 v72.03,110.29 | v68.33,8 v68.33,4.7
CLK  (via drill 0.35)
  Top 0.254: U$4.11 79.76,119.51 79.22,120.04 v74.14,120.04
  Bottom 0.254: v74.14,120.04 72.47,120.04 72.11,120.4 70.87,120.4 70.48,120.78 68.89,120.78 U$10.5
DATA
  Top 0.254: U$10.4 65.09,114.87 68.07,111.89 U$4.08
ESCID_1
  Top 0.203: U$11.12 16.78,95.78 R4.2
ESCID_2
  Top 0.203: U$13.12 16.53,51.79 R1.2
ESCID_3
  Top 0.203: U$12.12 16.53,8.61 R5.2
GND_L  (via drill 0.35)
  Top 0.203: C4.2 17.23,85.47 v15.49,85.47
  Top 0.254: U$8.1 v3.56,97.66
  Top 0.508: U$10.3 67.64,121.54 v70.61,121.54 | v75.18,121.28 79.27,121.28 79.8,120.75 81.76,120.75 U$4.05 U$4.06
  Bottom 0.508: v70.61,121.54 74.93,121.54 v75.18,121.28 | U$10.3 63.06,116.95 63.06,116 U$10.2
  other vias: 5.84,127.64 5.59,122.81 9.65,123.32 28.96,114.68 12.45,111.38 9.14,129.41 29.72,110.87 28.96,106.3 62.48,80.14 62.74,73.53 65.79,57.02 63.5,38.73 63.25,26.04 24.13,6.73 15.24,72.52 16.76,78.61 20.83,93.6 13.46,46.86 13.97,39.24 7.62,35.43 13.97,29.84 8.13,26.04 8.13,45.85 7.87,73.03 8.38,101.22 13.21,6.22 59.44,120.27 59.94,117.73 62.48,104.78 79.5,132.72 84.58,132.21 74.17,105.79 74.17,99.19 8.64,95.12 7.11,86.23 3.3,61.6 12.95,99.19
  pour Bottom (isolate 0.61, rank 6): -2.54,137.8 91.44,137.8 91.44,-6.99 -2.54,-6.99
  pour Top (isolate 0.61, rank 6): -2.54,137.8 92.46,137.8 92.46,-7.49 -3.05,-7.49 -3.05,137.8
N$3
  Top 0.203: C4.1 19.01,88.26 R8.2 19.01,88.99 19.9,89.88 R7.1
NRST  (via drill 0.35)
  Top 0.254: R9.1 U$8.2 3.86,89.28 v11.43,89.28 | D2.C v10.16,61.34 | v10.16,17.91 D3.C | v11.43,110.11 v11.43,105.79 11.68,105.79 12.31,105.16 D1.C | v61.21,112.65 61.21,110.62 62.48,109.35 D4.C
  Bottom 0.254: J3.6 11.04,106.18 v11.43,105.79 v11.43,89.28 11.43,88.26 10.16,87 v10.16,61.34 v10.16,17.91 | v11.43,110.11 12.45,110.11 14.22,111.89 14.22,115.95 16.26,117.98 21.34,117.98 22.86,119.51 28.7,119.51 34.09,114.12 46.62,114.12 46.92,114.43 60.71,114.43 61.21,113.92 v61.21,112.65
NRST_1
  Top 0.254: D1.A 16.76,104.78 U$11.06
NRST_2
  Top 0.203: D2.A 16.51,61.34 U$13.06
NRST_3
  Top 0.203: D3.A 16.51,17.91 U$12.06
NRST_4  (via drill 0.35)
  Top 0.254: v68.07,109.35 D4.A
  Bottom 0.254: U$10.13 74.14,118.04 74.14,115.57 74.17,115.54 74.17,109.85 73.66,109.35 v68.07,109.35
PROG_1
  Top 0.254: J3.2 6.97,119.76 MUX.10
PROG_3  (via drill 0.35)
  Top 0.254: v13.46,118.75 10.96,118.75 J3.4 | v13.46,121.03 MUX.9
  Bottom 0.254: v13.46,121.03 v13.46,118.75
SOL1_1
  Top 0.762: J8.3 82.04,60.91 U$9.2
SOL2_1
  Top 0.762: U$9.4 80.52,29.08 80.52,61.88 J8.4
SOL3_1
  Top 0.762: U$9.6 79.25,27.81 79.25,63.12 J8.5
SOL4_1
  Top 0.762: U$9.8 77.98,26.54 77.98,64.34 J8.6
SOL5_1
  Top 0.762: J8.7 76.45,65.32 76.45,25.53 U$9.10
SOL6_1
  Top 0.762: U$9.12 74.93,24.51 74.93,66.3 J8.8
SWCLK_1  (via drill 0.35)
  Top 0.203: U$11.11 18.98,98.96 v22.25,98.96
  Top 0.254: v21.84,117.22 MUX.12
  Bottom 0.254: v22.25,98.96 22.25,116.81 v21.84,117.22
SWCLK_2  (via drill 0.35)
  Top 0.254: MUX.14 20.83,114.68 21.84,113.66 21.84,110.62 24.13,108.33 v24.13,103.76 | U$13.11 22.69,55.33 v24.13,56.77
  Bottom 0.254: v24.13,103.76 v24.13,56.77
SWCLK_3  (via drill 0.35)
  Top 0.254: MUX.15 20.57,113.41 21.08,112.9 v21.08,101.98 | U$12.11 v22.88,11.89 v22.89,11.89
  Bottom 0.254: v21.08,101.98 21.08,96.9 22.89,95.1 v22.89,11.89
SWCLK_4  (via drill 0.35)
  Top 0.254: MUX.11 20.55,118.49 22.33,120.27 v22.35,120.27
  Bottom 0.254: U$10.8 69.09,114.94 66.8,112.65 63.42,112.65 59.87,116.21 47.84,116.21 46.22,114.58 37.19,114.58 31.5,120.27 v22.35,120.27
SWCLK_IN
  Top 0.254: J3.7 7.11,107.4 7.11,110.62 12.45,115.95 MUX.13
SWDIO_1
  Top 0.254: MUX.1 25.15,112.14 25.4,111.89 25.4,103.25 22.91,100.76 U$11.09
SWDIO_2
  Top 0.203: U$13.09 18.57,57.28 22.35,57.28
  Top 0.254: MUX.5 26.16,117.22 26.67,116.71 26.67,61.6 22.35,57.28
SWDIO_3  (via drill 0.35)
  Top 0.254: MUX.2 25.4,113.41 25.91,112.9 25.91,63.63 v25.65,63.37 | v25.65,58.55 25.65,15.62 23.92,13.89 U$12.09
  Bottom 0.254: v25.65,63.37 v25.65,58.55
SWDIO_4  (via drill 0.35)
  Top 0.254: MUX.4 v25.91,115.95 | v63.42,113.66 v60.48,113.66
  Bottom 0.254: v25.91,115.95 30.23,115.95 32.51,113.66 v60.48,113.66 | U$10.6 67.09,114.21 66.55,113.66 v63.42,113.66
SWDIO_IN  (via drill 0.35)
  Top 0.254: J3.8 8.38,106.17 8.38,109.85 13.72,115.19 v16,115.19 | v21.34,115.19 22.45,115.19 22.96,114.68 MUX.3
  Bottom 0.254: v21.34,115.19 v16,115.19

### Text on the board
tNames: X14 Backplane v1 / Brandon, Read Hedl / Erin Park, Katherine Sandys / 3/14/2022